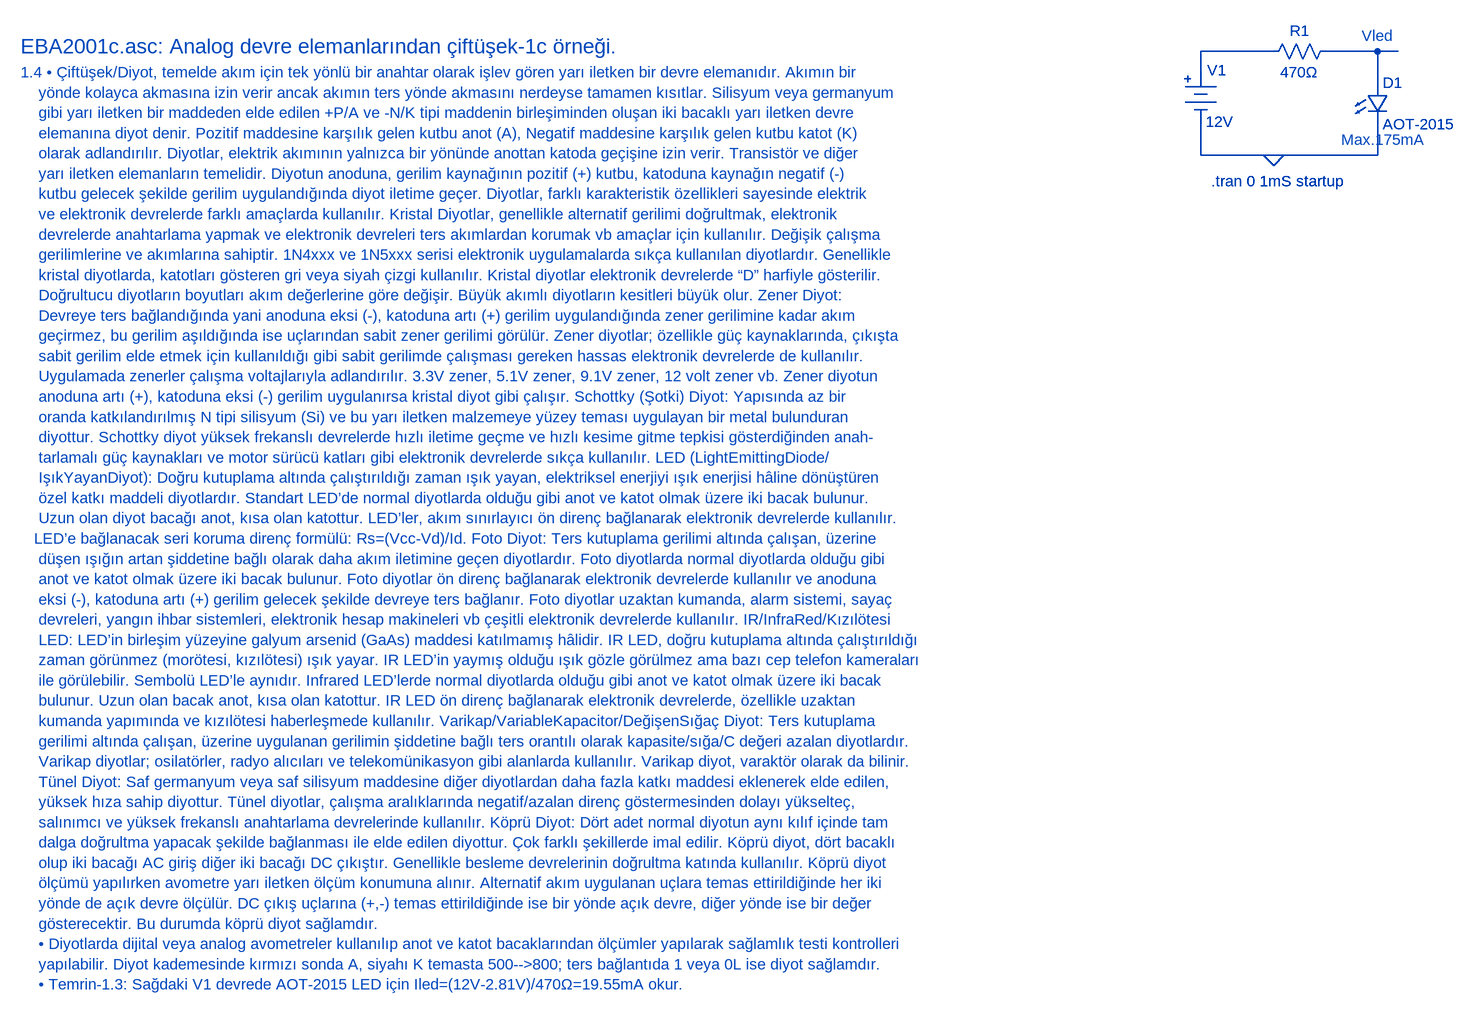
[diagram p0: schematic EBA2001c.asc]
EBA2001c.asc, the LTspice schematic file:
Version 4
SHEET 1 7064 4332
WIRE 1696 64 1584 64
WIRE 1856 64 1776 64
WIRE 1888 64 1856 64
WIRE 1584 96 1584 64
WIRE 1856 112 1856 64
WIRE 1584 224 1584 176
WIRE 1696 224 1584 224
WIRE 1856 224 1856 176
WIRE 1856 224 1696 224
FLAG 1696 224 0
SYMBOL Misc\\battery 1584 80 R0
WINDOW 0 10 13 Left 2
WINDOW 3 8 92 Left 2
SYMATTR InstName V1
SYMATTR Value 12V
SYMBOL res 1792 48 R90
WINDOW 0 0 56 VBottom 2
WINDOW 3 32 56 VTop 2
SYMATTR InstName R1
SYMATTR Value 470Ω
SYMBOL LED 1840 112 R0
SYMATTR InstName D1
SYMATTR Value AOT-2015
SYMATTR Description Diode
SYMATTR Type diode
TEXT -232 56 Left 3 ;EBA2001c.asc: Analog devre elemanlarından çiftüşek-1c örneği.
TEXT -232 96 Left 2 ;1.4 • Çiftüşek/Diyot, temelde akım için tek yönlü bir anahtar olarak işlev gören yarı iletken bir devre elemanıdır. Akımın bir \n    yönde kolayca akmasına izin verir ancak akımın ters yönde akmasını nerdeyse tamamen kısıtlar. Silisyum veya germanyum \n    gibi yarı iletken bir maddeden elde edilen +P/A ve -N/K tipi maddenin birleşiminden oluşan iki bacaklı yarı iletken devre \n    elemanına diyot denir. Pozitif maddesine karşılık gelen kutbu anot (A), Negatif maddesine karşılık gelen kutbu katot (K) \n    olarak adlandırılır. Diyotlar, elektrik akımının yalnızca bir yönünde anottan katoda geçişine izin verir. Transistör ve diğer \n    yarı iletken elemanların temelidir. Diyotun anoduna, gerilim kaynağının pozitif (+) kutbu, katoduna kaynağın negatif (-) \n    kutbu gelecek şekilde gerilim uygulandığında diyot iletime geçer. Diyotlar, farklı karakteristik özellikleri sayesinde elektrik \n    ve elektronik devrelerde farklı amaçlarda kullanılır. Kristal Diyotlar, genellikle alternatif gerilimi doğrultmak, elektronik \n    devrelerde anahtarlama yapmak ve elektronik devreleri ters akımlardan korumak vb amaçlar için kullanılır. Değişik çalışma \n    gerilimlerine ve akımlarına sahiptir. 1N4xxx ve 1N5xxx serisi elektronik uygulamalarda sıkça kullanılan diyotlardır. Genellikle \n    kristal diyotlarda, katotları gösteren gri veya siyah çizgi kullanılır. Kristal diyotlar elektronik devrelerde “D” harfiyle gösterilir. \n    Doğrultucu diyotların boyutları akım değerlerine göre değişir. Büyük akımlı diyotların kesitleri büyük olur. Zener Diyot: \n    Devreye ters bağlandığında yani anoduna eksi (-), katoduna artı (+) gerilim uygulandığında zener gerilimine kadar akım \n    geçirmez, bu gerilim aşıldığında ise uçlarından sabit zener gerilimi görülür. Zener diyotlar; özellikle güç kaynaklarında, çıkışta \n    sabit gerilim elde etmek için kullanıldığı gibi sabit gerilimde çalışması gereken hassas elektronik devrelerde de kullanılır.\n    Uygulamada zenerler çalışma voltajlarıyla adlandırılır. 3.3V zener, 5.1V zener, 9.1V zener, 12 volt zener vb. Zener diyotun \n    anoduna artı (+), katoduna eksi (-) gerilim uygulanırsa kristal diyot gibi çalışır. Schottky (Şotki) Diyot: Yapısında az bir \n    oranda katkılandırılmış N tipi silisyum (Si) ve bu yarı iletken malzemeye yüzey teması uygulayan bir metal bulunduran \n    diyottur. Schottky diyot yüksek frekanslı devrelerde hızlı iletime geçme ve hızlı kesime gitme tepkisi gösterdiğinden anah-\n    tarlamalı güç kaynakları ve motor sürücü katları gibi elektronik devrelerde sıkça kullanılır. LED (LightEmittingDiode/\n    IşıkYayanDiyot): Doğru kutuplama altında çalıştırıldığı zaman ışık yayan, elektriksel enerjiyi ışık enerjisi hâline dönüştüren \n    özel katkı maddeli diyotlardır. Standart LED’de normal diyotlarda olduğu gibi anot ve katot olmak üzere iki bacak bulunur.\n    Uzun olan diyot bacağı anot, kısa olan katottur. LED’ler, akım sınırlayıcı ön direnç bağlanarak elektronik devrelerde kullanılır. \n   LED’e bağlanacak seri koruma direnç formülü: Rs=(Vcc-Vd)/Id. Foto Diyot: Ters kutuplama gerilimi altında çalışan, üzerine \n    düşen ışığın artan şiddetine bağlı olarak daha akım iletimine geçen diyotlardır. Foto diyotlarda normal diyotlarda olduğu gibi \n    anot ve katot olmak üzere iki bacak bulunur. Foto diyotlar ön direnç bağlanarak elektronik devrelerde kullanılır ve anoduna \n    eksi (-), katoduna artı (+) gerilim gelecek şekilde devreye ters bağlanır. Foto diyotlar uzaktan kumanda, alarm sistemi, sayaç \n    devreleri, yangın ihbar sistemleri, elektronik hesap makineleri vb çeşitli elektronik devrelerde kullanılır. IR/InfraRed/Kızılötesi\n    LED: LED’in birleşim yüzeyine galyum arsenid (GaAs) maddesi katılmamış hâlidir. IR LED, doğru kutuplama altında çalıştırıldığı \n    zaman görünmez (morötesi, kızılötesi) ışık yayar. IR LED’in yaymış olduğu ışık gözle görülmez ama bazı cep telefon kameraları \n    ile görülebilir. Sembolü LED’le aynıdır. Infrared LED’lerde normal diyotlarda olduğu gibi anot ve katot olmak üzere iki bacak \n    bulunur. Uzun olan bacak anot, kısa olan katottur. IR LED ön direnç bağlanarak elektronik devrelerde, özellikle uzaktan \n    kumanda yapımında ve kızılötesi haberleşmede kullanılır. Varikap/VariableKapacitor/DeğişenSığaç Diyot: Ters kutuplama \n    gerilimi altında çalışan, üzerine uygulanan gerilimin şiddetine bağlı ters orantılı olarak kapasite/sığa/C değeri azalan diyotlardır. \n    Varikap diyotlar; osilatörler, radyo alıcıları ve telekomünikasyon gibi alanlarda kullanılır. Varikap diyot, varaktör olarak da bilinir.\n    Tünel Diyot: Saf germanyum veya saf silisyum maddesine diğer diyotlardan daha fazla katkı maddesi eklenerek elde edilen,\n    yüksek hıza sahip diyottur. Tünel diyotlar, çalışma aralıklarında negatif/azalan direnç göstermesinden dolayı yükselteç, \n    salınımcı ve yüksek frekanslı anahtarlama devrelerinde kullanılır. Köprü Diyot: Dört adet normal diyotun aynı kılıf içinde tam \n    dalga doğrultma yapacak şekilde bağlanması ile elde edilen diyottur. Çok farklı şekillerde imal edilir. Köprü diyot, dört bacaklı \n    olup iki bacağı AC giriş diğer iki bacağı DC çıkıştır. Genellikle besleme devrelerinin doğrultma katında kullanılır. Köprü diyot \n    ölçümü yapılırken avometre yarı iletken ölçüm konumuna alınır. Alternatif akım uygulanan uçlara temas ettirildiğinde her iki \n    yönde de açık devre ölçülür. DC çıkış uçlarına (+,-) temas ettirildiğinde ise bir yönde açık devre, diğer yönde ise bir değer \n    gösterecektir. Bu durumda köprü diyot sağlamdır.\n    • Diyotlarda dijital veya analog avometreler kullanılıp anot ve katot bacaklarından ölçümler yapılarak sağlamlık testi kontrolleri \n    yapılabilir. Diyot kademesinde kırmızı sonda A, siyahı K temasta 500-->800; ters bağlantıda 1 veya 0L ise diyot sağlamdır.\n    • Temrin-1.3: Sağdaki V1 devrede AOT-2015 LED için Iled=(12V-2.81V)/470Ω=19.55mA okur.
TEXT 1800 200 Left 2 ;Max.175mA
TEXT 1832 40 Left 2 ;Vled
TEXT 1600 264 Left 2 !.tran 0 1mS startup

The netlist it stands for:
* EBA2001c.asc
V1 N001 0 12V
R1 N002 N001 470Ω
D1 N002 0 AOT-2015
.model D D
.lib standard.dio
* EBA2001c.asc: Analog devre elemanlarından çiftüşek-1c örneği.
* 1.4 • Çiftüşek/Diyot, temelde akım için tek yönlü bir anahtar olarak işlev gören yarı iletken bir devre elemanıdır. Akımın bir
*     yönde kolayca akmasına izin verir ancak akımın ters yönde akmasını nerdeyse tamamen kısıtlar. Silisyum veya germanyum
*     gibi yarı iletken bir maddeden elde edilen +P/A ve -N/K tipi maddenin birleşiminden oluşan iki bacaklı yarı iletken devre
*     elemanına diyot denir. Pozitif maddesine karşılık gelen kutbu anot (A), Negatif maddesine karşılık gelen kutbu katot (K)
*     olarak adlandırılır. Diyotlar, elektrik akımının yalnızca bir yönünde anottan katoda geçişine izin verir. Transistör ve diğer
*     yarı iletken elemanların temelidir. Diyotun anoduna, gerilim kaynağının pozitif (+) kutbu, katoduna kaynağın negatif (-)
*     kutbu gelecek şekilde gerilim uygulandığında diyot iletime geçer. Diyotlar, farklı karakteristik özellikleri sayesinde elektrik
*     ve elektronik devrelerde farklı amaçlarda kullanılır. Kristal Diyotlar, genellikle alternatif gerilimi doğrultmak, elektronik
*     devrelerde anahtarlama yapmak ve elektronik devreleri ters akımlardan korumak vb amaçlar için kullanılır. Değişik çalışma
*     gerilimlerine ve akımlarına sahiptir. 1N4xxx ve 1N5xxx serisi elektronik uygulamalarda sıkça kullanılan diyotlardır. Genellikle
*     kristal diyotlarda, katotları gösteren gri veya siyah çizgi kullanılır. Kristal diyotlar elektronik devrelerde “D” harfiyle gösterilir.
*     Doğrultucu diyotların boyutları akım değerlerine göre değişir. Büyük akımlı diyotların kesitleri büyük olur. Zener Diyot:
*     Devreye ters bağlandığında yani anoduna eksi (-), katoduna artı (+) gerilim uygulandığında zener gerilimine kadar akım
*     geçirmez, bu gerilim aşıldığında ise uçlarından sabit zener gerilimi görülür. Zener diyotlar; özellikle güç kaynaklarında, çıkışta
*     sabit gerilim elde etmek için kullanıldığı gibi sabit gerilimde çalışması gereken hassas elektronik devrelerde de kullanılır.
*     Uygulamada zenerler çalışma voltajlarıyla adlandırılır. 3.3V zener, 5.1V zener, 9.1V zener, 12 volt zener vb. Zener diyotun
*     anoduna artı (+), katoduna eksi (-) gerilim uygulanırsa kristal diyot gibi çalışır. Schottky (Şotki) Diyot: Yapısında az bir
*     oranda katkılandırılmış N tipi silisyum (Si) ve bu yarı iletken malzemeye yüzey teması uygulayan bir metal bulunduran
*     diyottur. Schottky diyot yüksek frekanslı devrelerde hızlı iletime geçme ve hızlı kesime gitme tepkisi gösterdiğinden anah-
*     tarlamalı güç kaynakları ve motor sürücü katları gibi elektronik devrelerde sıkça kullanılır. LED (LightEmittingDiode/
*     IşıkYayanDiyot): Doğru kutuplama altında çalıştırıldığı zaman ışık yayan, elektriksel enerjiyi ışık enerjisi hâline dönüştüren
*     özel katkı maddeli diyotlardır. Standart LED’de normal diyotlarda olduğu gibi anot ve katot olmak üzere iki bacak bulunur.
*     Uzun olan diyot bacağı anot, kısa olan katottur. LED’ler, akım sınırlayıcı ön direnç bağlanarak elektronik devrelerde kullanılır.
*    LED’e bağlanacak seri koruma direnç formülü: Rs=(Vcc-Vd)/Id. Foto Diyot: Ters kutuplama gerilimi altında çalışan, üzerine
*     düşen ışığın artan şiddetine bağlı olarak daha akım iletimine geçen diyotlardır. Foto diyotlarda normal diyotlarda olduğu gibi
*     anot ve katot olmak üzere iki bacak bulunur. Foto diyotlar ön direnç bağlanarak elektronik devrelerde kullanılır ve anoduna
*     eksi (-), katoduna artı (+) gerilim gelecek şekilde devreye ters bağlanır. Foto diyotlar uzaktan kumanda, alarm sistemi, sayaç
*     devreleri, yangın ihbar sistemleri, elektronik hesap makineleri vb çeşitli elektronik devrelerde kullanılır. IR/InfraRed/Kızılötesi
*     LED: LED’in birleşim yüzeyine galyum arsenid (GaAs) maddesi katılmamış hâlidir. IR LED, doğru kutuplama altında çalıştırıldığı
*     zaman görünmez (morötesi, kızılötesi) ışık yayar. IR LED’in yaymış olduğu ışık gözle görülmez ama bazı cep telefon kameraları
*     ile görülebilir. Sembolü LED’le aynıdır. Infrared LED’lerde normal diyotlarda olduğu gibi anot ve katot olmak üzere iki bacak
*     bulunur. Uzun olan bacak anot, kısa olan katottur. IR LED ön direnç bağlanarak elektronik devrelerde, özellikle uzaktan
*     kumanda yapımında ve kızılötesi haberleşmede kullanılır. Varikap/VariableKapacitor/DeğişenSığaç Diyot: Ters kutuplama
*     gerilimi altında çalışan, üzerine uygulanan gerilimin şiddetine bağlı ters orantılı olarak kapasite/sığa/C değeri azalan diyotlardır.
*     Varikap diyotlar; osilatörler, radyo alıcıları ve telekomünikasyon gibi alanlarda kullanılır. Varikap diyot, varaktör olarak da bilinir.
*     Tünel Diyot: Saf germanyum veya saf silisyum maddesine diğer diyotlardan daha fazla katkı maddesi eklenerek elde edilen,
*     yüksek hıza sahip diyottur. Tünel diyotlar, çalışma aralıklarında negatif/azalan direnç göstermesinden dolayı yükselteç,
*     salınımcı ve yüksek frekanslı anahtarlama devrelerinde kullanılır. Köprü Diyot: Dört adet normal diyotun aynı kılıf içinde tam
*     dalga doğrultma yapacak şekilde bağlanması ile elde edilen diyottur. Çok farklı şekillerde imal edilir. Köprü diyot, dört bacaklı
*     olup iki bacağı AC giriş diğer iki bacağı DC çıkıştır. Genellikle besleme devrelerinin doğrultma katında kullanılır. Köprü diyot
*     ölçümü yapılırken avometre yarı iletken ölçüm konumuna alınır. Alternatif akım uygulanan uçlara temas ettirildiğinde her iki
*     yönde de açık devre ölçülür. DC çıkış uçlarına (+,-) temas ettirildiğinde ise bir yönde açık devre, diğer yönde ise bir değer
*     gösterecektir. Bu durumda köprü diyot sağlamdır.
*     • Diyotlarda dijital veya analog avometreler kullanılıp anot ve katot bacaklarından ölçümler yapılarak sağlamlık testi kontrolleri
*     yapılabilir. Diyot kademesinde kırmızı sonda A, siyahı K temasta 500-->800; ters bağlantıda 1 veya 0L ise diyot sağlamdır.
*     • Temrin-1.3: Sağdaki V1 devrede AOT-2015 LED için Iled=(12V-2.81V)/470Ω=19.55mA okur.
* Max.175mA
* Vled
.tran 0 1mS startup
.backanno
.end